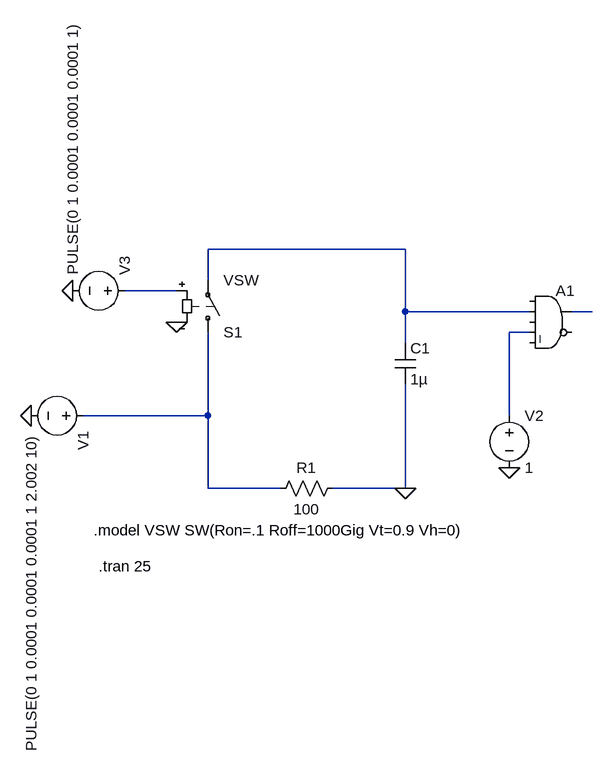
[diagram p0: schematic RAM write and read circuit.asc]
RAM write and read circuit.asc, the LTspice schematic file:
Version 4.1
SHEET 1 1012 848
WIRE 720 -16 416 -16
WIRE 416 32 416 -16
WIRE 368 48 288 48
WIRE 720 80 720 -16
WIRE 912 80 720 80
WIRE 1008 80 976 80
WIRE 912 112 880 112
WIRE 720 128 720 80
WIRE 416 240 416 112
WIRE 416 240 224 240
WIRE 880 240 880 112
WIRE 416 352 416 240
WIRE 528 352 416 352
WIRE 720 352 720 192
WIRE 720 352 608 352
FLAG 368 96 0
FLAG 144 240 0
FLAG 720 352 0
FLAG 880 320 0
FLAG 208 48 0
SYMBOL sw 416 128 M180
SYMATTR InstName S1
SYMATTR Value VSW
SYMBOL cap 704 128 R0
SYMATTR InstName C1
SYMATTR Value 1µ
SYMBOL res 624 336 R90
WINDOW 0 0 56 VBottom 2
WINDOW 3 32 56 VTop 2
SYMATTR InstName R1
SYMATTR Value 100
SYMBOL voltage 240 240 R90
WINDOW 123 0 0 Left 0
WINDOW 39 0 0 Left 0
SYMATTR InstName V1
SYMATTR Value PULSE(0 1 0.0001 0.0001 0.0001 1 2.002 10)
SYMBOL Digital\\and 944 32 R0
SYMATTR InstName A1
SYMBOL voltage 880 224 R0
SYMATTR InstName V2
SYMATTR Value 1
SYMBOL voltage 304 48 M270
WINDOW 123 0 0 Left 0
WINDOW 39 0 0 Left 0
SYMATTR InstName V3
SYMATTR Value PULSE(0 1 0.0001 0.0001 0.0001 1)
TEXT 248 472 Left 2 !.tran 25
TEXT 240 416 Left 2 !.model VSW SW(Ron=.1 Roff=1000Gig Vt=0.9 Vh=0)

The netlist it stands for:
* RAM write and read circuit.asc
S1 N005 N001 N002 0 VSW
C1 N001 0 1µ
R1 0 N005 100
V1 N005 0 PULSE(0 1 0.0001 0.0001 0.0001 1 2.002 10)
A1 0 N001 0 N004 0 0 N003 0 AND
V2 N004 0 1
V3 N002 0 PULSE(0 1 0.0001 0.0001 0.0001 1)
.tran 25
.model VSW SW(Ron=.1 Roff=1000Gig Vt=0.9 Vh=0)
.backanno
.end